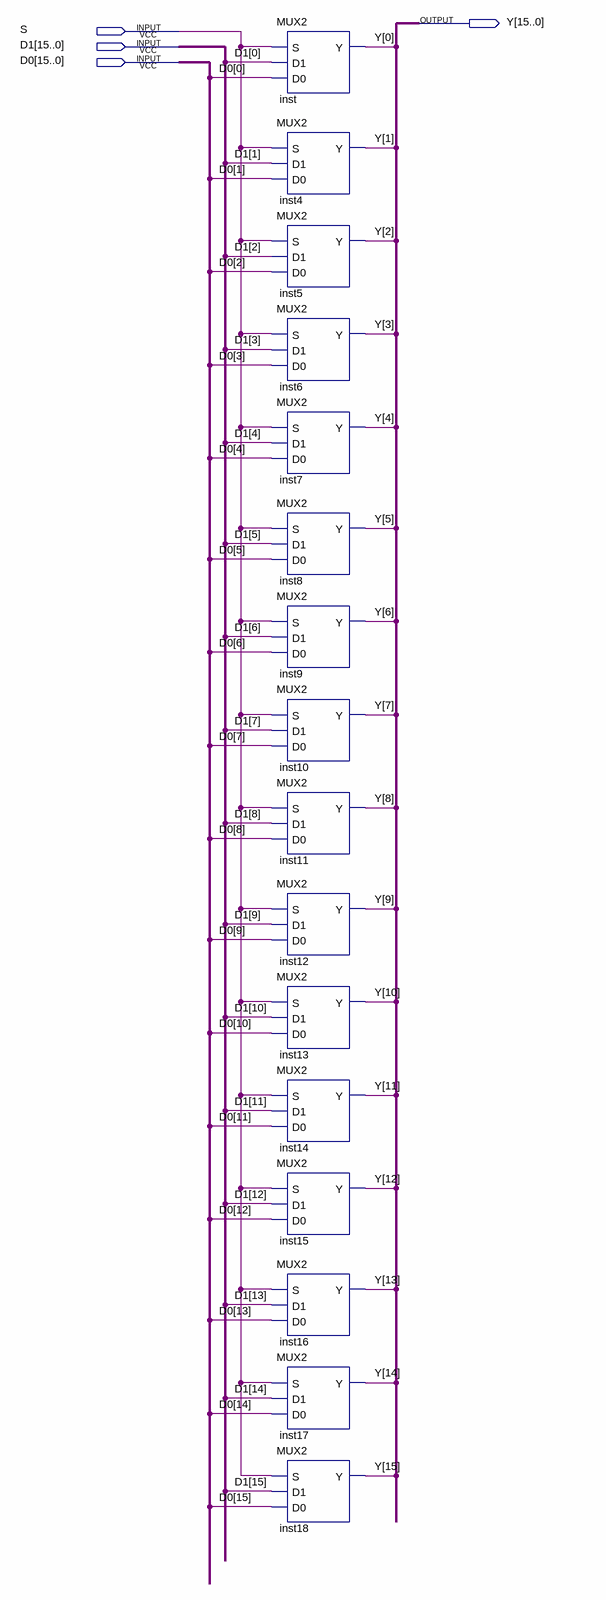
[diagram p0: schematic sheet]
// Quartus schematic MUX2_16BIT.bdf as structural Verilog: 16 symbols, 4 pins
module MUX2_16BIT (
  input  S,
  input  [15:0] D1,
  input  [15:0] D0,
  output [15:0] Y
);

  MUX2 inst (.S(S), .D1(D1[0]), .D0(D0[0]), .Y(Y[0]));
  MUX2 inst4 (.S(S), .D1(D1[1]), .D0(D0[1]), .Y(Y[1]));
  MUX2 inst5 (.S(S), .D1(D1[2]), .D0(D0[2]), .Y(Y[2]));
  MUX2 inst6 (.S(S), .D1(D1[3]), .D0(D0[3]), .Y(Y[3]));
  MUX2 inst7 (.S(S), .D1(D1[4]), .D0(D0[4]), .Y(Y[4]));
  MUX2 inst8 (.S(S), .D1(D1[5]), .D0(D0[5]), .Y(Y[5]));
  MUX2 inst9 (.S(S), .D1(D1[6]), .D0(D0[6]), .Y(Y[6]));
  MUX2 inst10 (.S(S), .D1(D1[7]), .D0(D0[7]), .Y(Y[7]));
  MUX2 inst11 (.S(S), .D1(D1[8]), .D0(D0[8]), .Y(Y[8]));
  MUX2 inst12 (.S(S), .D1(D1[9]), .D0(D0[9]), .Y(Y[9]));
  MUX2 inst13 (.S(S), .D1(D1[10]), .D0(D0[10]), .Y(Y[10]));
  MUX2 inst14 (.S(S), .D1(D1[11]), .D0(D0[11]), .Y(Y[11]));
  MUX2 inst15 (.S(S), .D1(D1[12]), .D0(D0[12]), .Y(Y[12]));
  MUX2 inst16 (.S(S), .D1(D1[13]), .D0(D0[13]), .Y(Y[13]));
  MUX2 inst17 (.S(S), .D1(D1[14]), .D0(D0[14]), .Y(Y[14]));
  MUX2 inst18 (.S(S), .D1(D1[15]), .D0(D0[15]), .Y(Y[15]));
endmodule
